# EAGLE design ATtiny20 Study - SOIC14 (EAGLE 7.2.0)
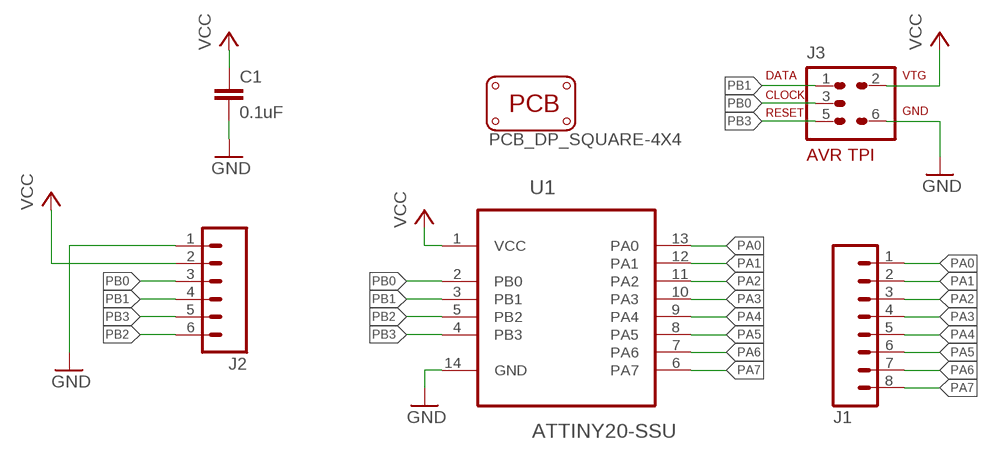
[diagram p0: schematic, sheet 1]

## Parts
C1  0.1uF  CAP0805  [0805]
J1  M08NO_SILK_FEMALE_PTH  [1X08_NO_SILK]
J2  M06NO_SILK_FEMALE_PTH  [1X06_NO_SILK]
J3  AVR-TPIVERT  [AVR-ISP-6]
PCB1  PCB_DP_SQUARE-4X4  [DP4040_V1]
U1  ATTINY20-SSU  [14S1]

## Nets
GND: C1.2 J2.1 J3.6 U1.14(GND)
PA0: J1.1 U1.13(PA0)
PA1: J1.2 U1.12(PA1)
PA2: J1.3 U1.11(PA2)
PA3: J1.4 U1.10(PA3)
PA4: J1.5 U1.9(PA4)
PA5: J1.6 U1.8(PA5)
PA6: J1.7 U1.7(PA6)
PA7: J1.8 U1.6(PA7)
PB0: J2.3 J3.3 U1.2(PB0)
PB1: J2.4 J3.1 U1.3(PB1)
PB2: J2.6 U1.5(PB2)
PB3: J2.5 J3.5 U1.4(PB3)
VCC: C1.1 J2.2 J3.2 U1.1(VCC)

## Library data of the parts
C1 = SparkFun-Capacitors:CAP: Capacitor Standard 0603 ceramic capacitor, and 0.1" leaded capacitor.
J1 = SparkFun-Connectors:M08: Header 8 Standard 8-pin 0.1" header. Use with straight break away headers (SKU : PRT-00116), right angle break away headers (PRT-00553), swiss pins (PRT-00743), machine pins (PRT-00117), and female headers (PRT-00115).; PROD_ID: CONN-08438
J2 = SparkFun-Connectors:M06: Header 6 Standard 6-pin 0.1" header. Use with straight break away headers (SKU : PRT-00116), right angle break away headers (PRT-00553), swiss pins (PRT-00743), machine pins (PRT-00117), and female headers (PRT-00115). Molex polarized connector foot print use with SKU : PRT-08094 with associated crimp pins and housings. NOTES ON THE VARIANTS LOCK and LOCK_LONGPADS... This footprint was designed to help hold the alignment of a through-hole component (i.e. 6-pin header) while soldering it into place. You may notice that each hole has been shifted either up or down by 0.005 of an inch from it's more standard position (which is a perfectly straight line). This slight alteration caused the pins (the squares in the middle) to touch the edges of the holes. Because they are alternating, it causes a "brace" to hold the component in place. 0.005 has proven to be the perfect amount of "off-center" position when using our standard breakaway headers. Although looks a little odd when you look at the bare footprint, once you have a header in there, the alteration is very hard to notice. Also,if you push a header all the way into place, it is covered up entirely on the bottom side. This idea of altering the position of holes to aid alignment will be further integrated into the Sparkfun Library for other footprints. It can help hold any component with 3 or more connection pins.; PROD_ID: CONN-08437
J3 = avr-7:AVR-TPI: AVR TPI connector
PCB1 = dp_pcb:PCB_DP_SQUARE: Dangerous Prototypes Standard Square PCB sizes
U1 = Atmel AVR8:ATTINY20-SSU: 8-bit Microcontroller with In-System Programmable Flash; MPN: ATTINY20-SSU; OC_NEWARK: 68T3540; PACKAGE: SOIC-14; SUPPLIER: Atmel

## Board
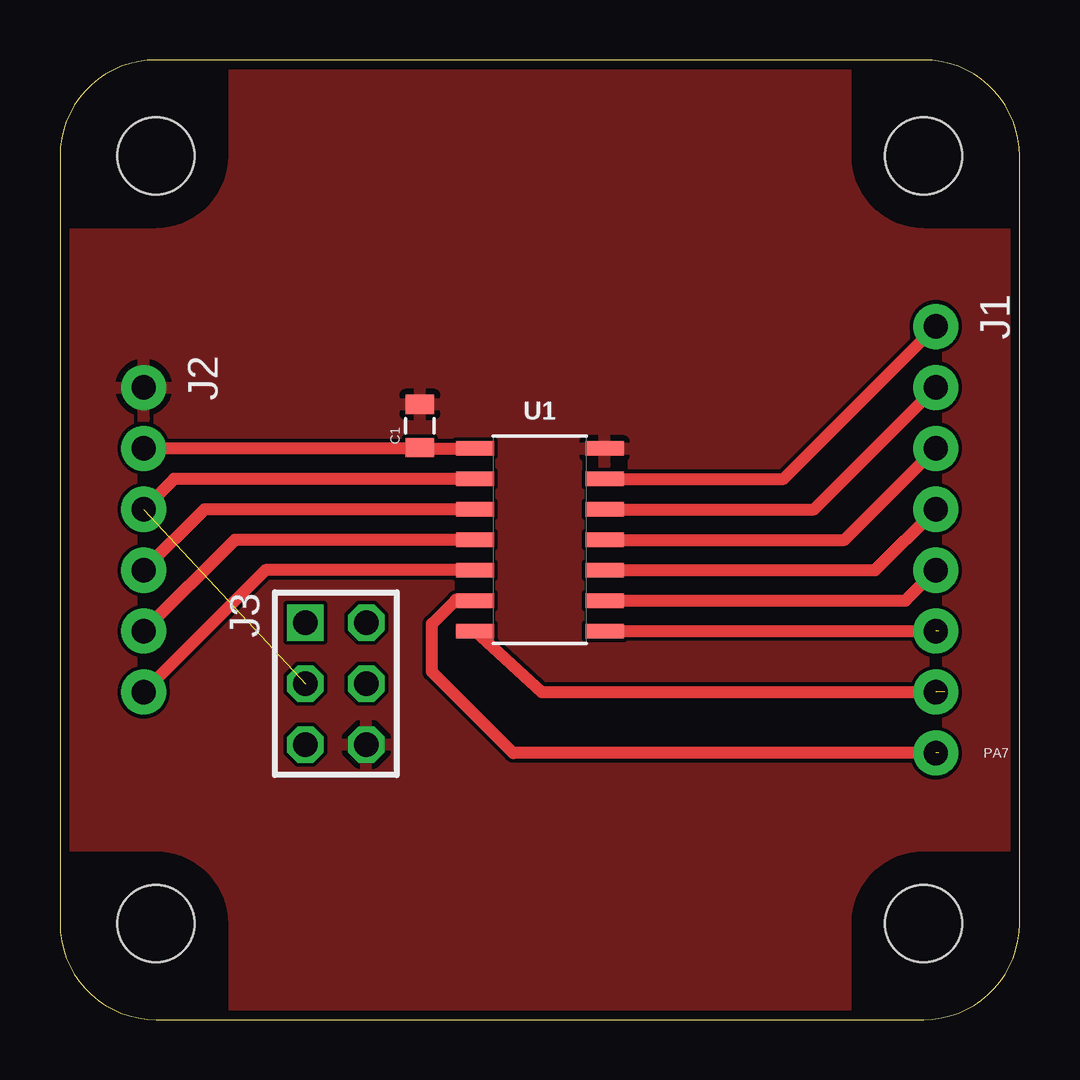
[diagram p1: board, top side]
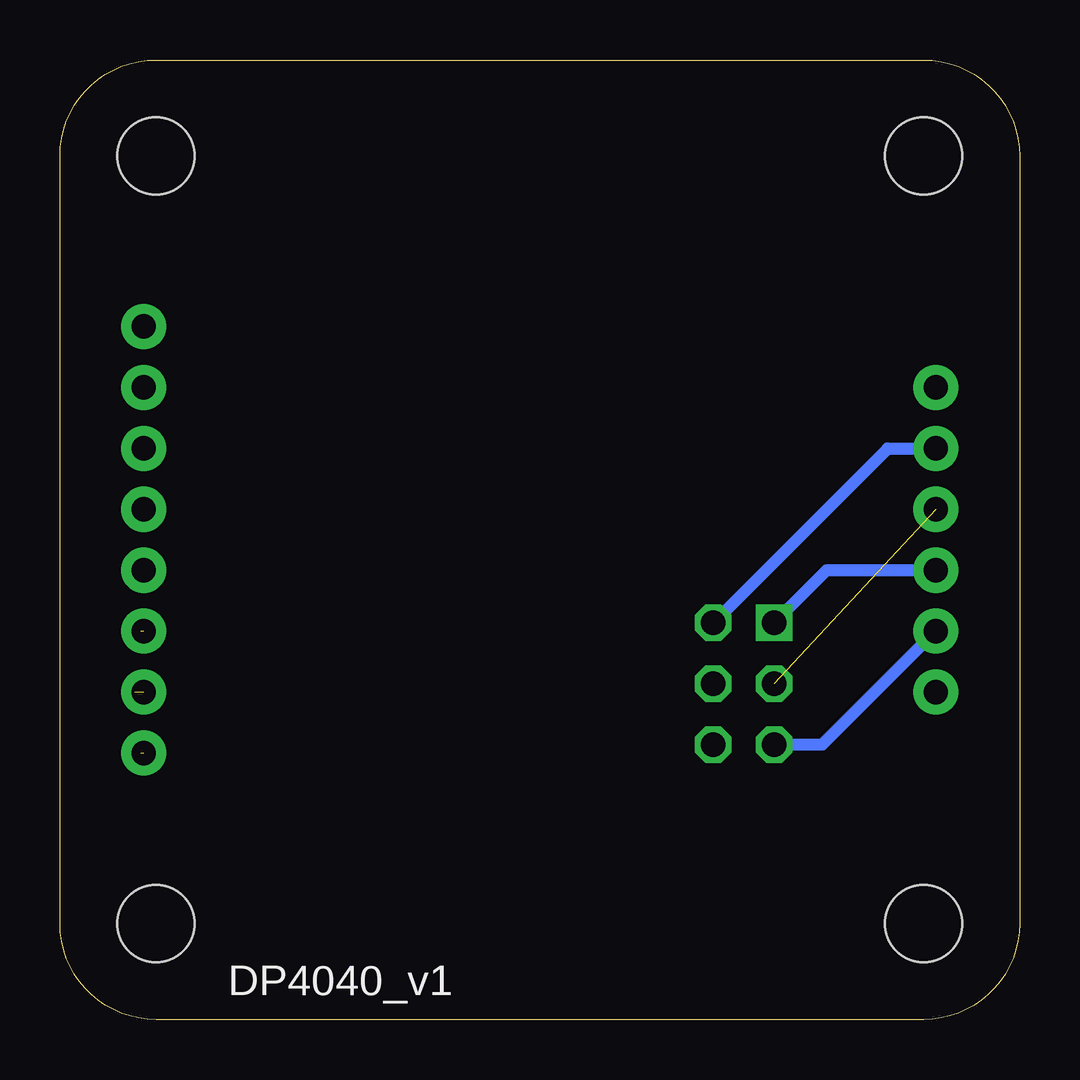
[diagram p2: board, bottom side, seen from below]

Size 40 x 40 mm. Coordinates in mm from the lower left corner, seen from the top.
Copper layers (1*16): Top 0.0356mm / dielectric 1.5011mm / Bottom 0.0356mm
Design rules "oshpark-2layer": minimum track width 6mil, minimum drill 13mil, track to track 6mil, track to pad 6mil, pad to pad 6mil, via to via 6mil, smd to smd 6mil, copper to edge 15mil, drill to drill 6mil, minimum pad ring 7mil, minimum via ring 7mil, stop-mask expansion 4mil, vias tented up to drill 0mil, thermal gap 10mil

### Footprints (pad centres in the part's own frame; a part is rotated, then mirrored left to right if it is on the bottom)
0805 = smd 0.8 x 1.2: 1 -0.9,0; 2 0.9,0
1X08_NO_SILK = drill 1.016 pad 1.88: 1 0,0; 2 2.54,0; 3 5.08,0; 4 7.62,0; 5 10.16,0; 6 12.7,0; 7 15.24,0; 8 17.78,0
1X06_NO_SILK = drill 1.016 pad 1.88: 1 0,0; 2 2.54,0; 3 5.08,0; 4 7.62,0; 5 10.16,0; 6 12.7,0
AVR-ISP-6 = drill 1.016 square: 1 -2.54,-1.27 | drill 1.016 octagon: 2 -2.54,1.27; 3 0,-1.27; 4 0,1.27; 5 2.54,-1.27; 6 2.54,1.27
DP4040_V1 = hole 3.2: 4,4; 36,4; 36,36; 4,36
14S1 = smd 1.6 x 0.6: 1 -2.7,3.81; 2 -2.7,2.54; 3 -2.7,1.27; 4 -2.7,0; 5 -2.7,-1.27; 6 -2.7,-2.54; 7 -2.7,-3.81; 8 2.7,-3.81; 9 2.7,-2.54; 10 2.7,-1.27; 11 2.7,0; 12 2.7,1.27; 13 2.7,2.54; 14 2.7,3.81

### Placement (x,y rotation side)
C1  15,24.75 90 top
J1  36.51,28.89 270 top
J2  3.49,26.35 270 top
J3  11.5,14 270 top
PCB1  0,0 0 top
U1  20,20 0 top

### Tracks (layer width: path | path; a pad name or v marks a point on that pad's centre or on a via)
GND
  pour Top: 0,0 40,0 40,40 0,40
PA0
  Top 0.5: U1.13 30.16,22.54 J1.1
PA1
  Top 0.5: U1.12 31.43,21.27 J1.2
PA2
  Top 0.5: U1.11 32.7,20 J1.3
PA3
  Top 0.5: U1.10 33.97,18.73 J1.4
PA4
  Top 0.5: U1.9 35.24,17.46 J1.5
PA5  (1 unrouted)
  Top 0.5: U1.8 36.64,16.19
PA6  (1 unrouted)
  Top 0.5: U1.7 20.08,13.65 36.89,13.65
PA7  (1 unrouted)
  Top 0.5: 36.64,11.11 18.89,11.11 15.5,14.5 15.5,16.5 16.5,17.5 17.5,17.5 U1.6
PB0  (1 unrouted)
  Top 0.5: U1.2 4.76,22.54 J2.3
PB1
  Top 0.5: U1.3 6.03,21.27 J2.4
  Bottom 0.5: J3.1 8.04,18.73 J2.4
PB2
  Top 0.5: U1.5 8.57,18.73 J2.6
PB3
  Top 0.5: U1.4 7.3,20 J2.5
  Bottom 0.5: J3.5 8.22,11.46 J2.5
VCC
  Top 0.5: J2.2 14.71,23.81 C1.1 15.29,23.81 U1.1
  Bottom 0.5: J3.2 5.5,23.81 J2.2

### Text on the board
tPlace: PA7